# Altium schematic sheet 24V_Main_Regulator.SchDoc (part 1 of 5)
size 431 x 279 mm; Organization: ORGANIZATION; Address1: ADDRESS 1; Address2: ADDRESS 2; Address3: ADDRESS 3; Address4: ADDRESS 4; Revision: -; SheetNumber: 3; SheetTotal: 6; ENG_APP_DATE: --/--/--; DSN_APP_DATE: --/--/--; CHK_APP_DATE: --/--/--
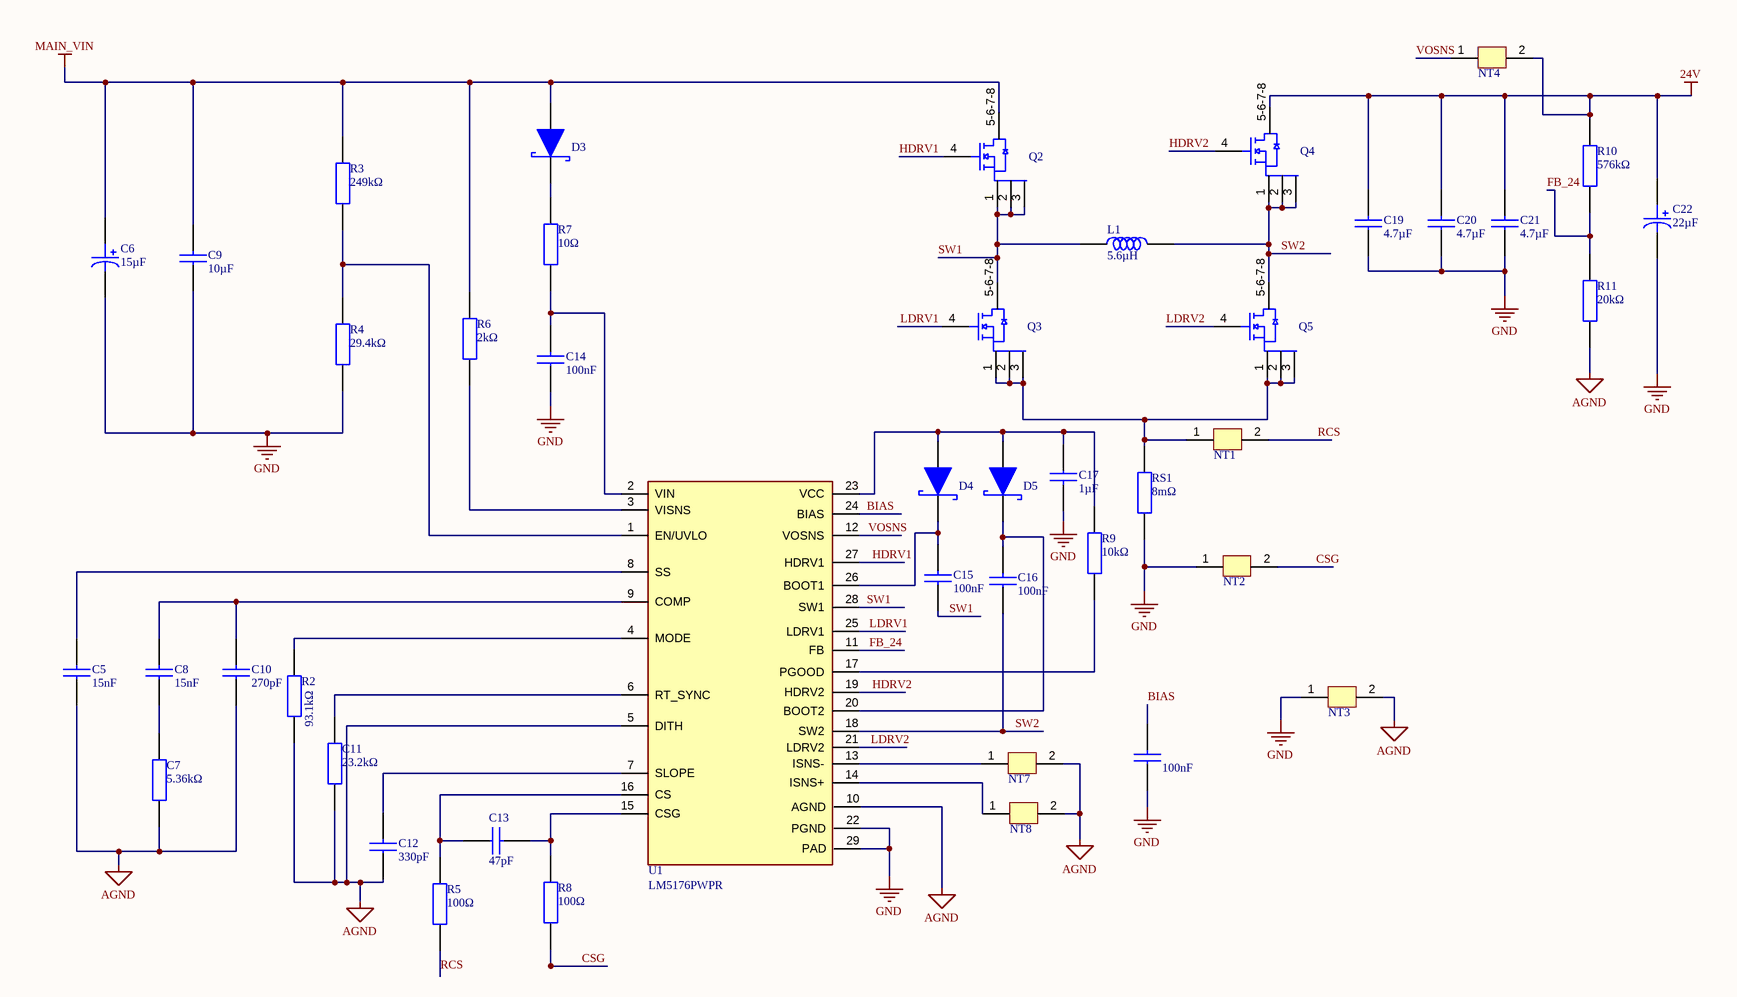
[diagram p0: 24V_Main_Regulator.SchDoc]

## Parts
C5  value 15nF  [CAP_0603]  (hidden comment: C0603C153J3GACTU)
C6  value 15µF  [CAP ALUM SMD]  (hidden comment: 100SXV15M)
C7  value 5.36kΩ  [RES_0402]  (hidden comment: CRCW04025K36FKED)
C8  value 15nF  [CAP_0402]  (hidden comment: CGA2B3X7R1H153K050BB)
C9  value 10µF  [CAP_2220]  (hidden comment: C5750X7S2A106M230KB)
C10  value 270pF  [CAP_0805]  (hidden comment: CL21C271JBANNNC)
C11  value 23.2kΩ  [RES_0402]  (hidden comment: CRCW040223K2FKED)
C12  value 330pF  [CAP_0603]  (hidden comment: CL10C331JB8NNNC)
C13  value 47pF  [CAP_0603]  (hidden comment: 06035A470JAT2A)
C14  value 100nF  [CAP_0603]  (hidden comment: CC0603KRX7R9BB104)
C15  value 100nF  [CAP_0603]  (hidden comment: 06033C104KAT2A)
C16  value 100nF  [CAP_0603]  (hidden comment: 06033C104KAT2A)
C17  value 1µF  [CAP_0603]  (hidden comment: EMK107B7105KA-T)
C18  value 100nF  [CAP_0805]  (hidden comment: C0805C104M5RACTU)
C19  value 4.7µF  [CAP_0805]  (hidden comment: MSASU21GBB5475KTNA01)
C20  value 4.7µF  [CAP_0805]  (hidden comment: MSASU21GBB5475KTNA01)
C21  value 4.7µF  [CAP_0805]  (hidden comment: MSASU21GBB5475KTNA01)
C22  value 22µF  [CAP ALUM SMD]  (hidden comment: 35SVPF22M)
D3  SS110  [SS110]  (value not drawn)
D4  SS110  [SS110]  (value not drawn)
D5  SS110  [SS110]  (value not drawn)
L1  value 5.6µH  [XAL1010]  (hidden comment: XAL1010-562MEB)
NT1  Net-Tie  [Net-Tie]  (value not drawn)  (net tie, no BOM)
NT2  Net-Tie  [Net-Tie]  (value not drawn)  (net tie, no BOM)
NT3  Net-Tie  [Net-Tie]  (value not drawn)  (net tie, no BOM)
NT4  Net-Tie  [Net-Tie]  (value not drawn)  (net tie, no BOM)
NT7  Net-Tie  [Net-Tie]  (value not drawn)  (net tie, no BOM)
NT8  Net-Tie  [Net-Tie]  (value not drawn)  (net tie, no BOM)
Q2  CSD19534Q5A  [SON 5X6]  (value not drawn)
Q3  CSD19534Q5A  [SON 5X6]  (value not drawn)
Q4  CSD18540Q5B  [SON 5X6]  (value not drawn)
Q5  CSD18531Q5A  [SON 5X6]  (value not drawn)
R2  value 93.1kΩ  [RES_0603]  (hidden comment: RC0603FR-0793K1L)
R3  value 249kΩ  [RES_0402]  (hidden comment: CRCW0402249KFKED)
R4  value 29.4kΩ  [RES_0402]  (hidden comment: CRCW040229K4FKED)
R5  value 100Ω  [RES_0603]  (hidden comment: CRCW0603100RFKEA)
R6  value 2kΩ  [RES_0603]  (hidden comment: CRCW06032K00FKEA)
R7  value 10Ω  [RES_0603]  (hidden comment: RC0603FR-0710RL)
R8  value 100Ω  [RES_0603]  (hidden comment: CRCW0603100RFKEA)
R9  value 10kΩ  [RES_0603]  (hidden comment: RC0603FR-0710KL)
R10  value 576kΩ  [RES_0603]  (hidden comment: RC0603FR-07576KL)
R11  value 20kΩ  [RES_0603]  (hidden comment: RC0603FR-0720KL)
RS1  value 8mΩ  [RES_2512]  (hidden comment: PMR100HZPFU8L00)
U1  LM5176PWPR  [28-HTSSOP]

## Nets
24V: C19.2 C20.2 C21.2 C22.1(C) NT4.2 Q4.5-6-7-8(D) R10.2
AGND: C5.1 C7.1 C10.1 C11.1 C12.1 NT3.2 NT7.2 NT8.2 R2.1 R11.1 U1.5(DITH) U1.10(AGND)
GND: C6.2(A) C9.1 C14.1 C17.2 C18.1 C19.1 C20.1 C21.1 C22.2(A) NT2.1 NT3.1 R4.1 RS1.1 U1.22(PGND) U1.29(PAD)
MAIN_VIN: C6.1(C) C9.2 D3.2(Anode) Q2.5-6-7-8(D) R3.2 R6.2
BIAS: C18.2 U1.24(BIAS)
CSG: NT2.2 R8.1
FB_24: R10.1 R11.2 U1.11(FB)
HDRV1: Q2.4(G) U1.27(HDRV1)
HDRV2: Q4.4(G) U1.19(HDRV2)
LDRV1: Q3.4(G) U1.25(LDRV1)
LDRV2: Q5.4(G) U1.21(LDRV2)
RCS: NT1.2 R5.1
SW1: C15.1 L1.1 Q2.1(S) Q2.2(S) Q2.3(S) Q3.5-6-7-8(D) U1.28(SW1)
SW2: C16.1 L1.2 Q4.1(S) Q4.2(S) Q4.3(S) Q5.5-6-7-8(D) U1.18(SW2)
VOSNS: NT4.1 U1.12(VOSNS)
NetC5_2: C5.2 U1.8(SS)
NetC7_2: C7.2 C8.1
NetC8_2: C8.2 C10.2 U1.9(COMP)
NetC11_2: C11.2 U1.6(RT_SYNC)
NetC12_2: C12.2 U1.7(SLOPE)
NetC13_1: C13.1 R5.2 U1.16(CS)
NetC13_2: C13.2 R8.2 U1.15(CSG)
NetC14_2: C14.2 R7.1 U1.2(VIN)
NetC15_2: C15.2 D4.1(Cathode) U1.26(BOOT1)
NetC16_2: C16.2 D5.1(Cathode) U1.20(BOOT2)
NetC17_1: C17.1 D4.2(Anode) D5.2(Anode) R9.2 U1.23(VCC)
NetD3_1: D3.1(Cathode) R7.2
NetNT1_1: NT1.1 Q3.1(S) Q3.2(S) Q3.3(S) Q5.1(S) Q5.2(S) Q5.3(S) RS1.2
NetNT7_1: NT7.1 U1.13(ISNS-)
NetNT8_1: NT8.1 U1.14(ISNS+)
NetR2_2: R2.2 U1.4(MODE)
NetR3_1: R3.1 R4.2 U1.1(EN/UVLO)
NetR6_1: R6.1 U1.3(VISNS)
NetR9_1: R9.1 U1.17(PGOOD)

## Notes on the sheet
- DWG. NO.
- REV.
- SHT.
- THIS DOCUMENT AND THE DATA DISCLOSED HEREIN OR HEREWITH IS THE PROPERTY OF ALTIUM LIMITED AND MAY BE FREELY DISTRIBUTED IN WHOLE. NO RIGHTS ARE RESERVED OR EXPRESS OR IMPLIED WARANTEE GIVEN.
- REVISION
- DESCRIPTION
- DATE
- APPROVED
- ENG:
- APPROVALS
- PROJECT
- DSN:
- CHK:
- REFERENCE DOCUMENTS
- PROJECT REVISION:
- TITLE
- DOCUMENT REVISION:
- DESIGN ITEM:
- BOM:
- FAB DWG:
- PCB DWG:
- ASSY DWG:
- SCALE:
- SIZE
- B
- CAGE CODE
- FILE NAME
- DWG NO.
- SHEET
- OF
- REV